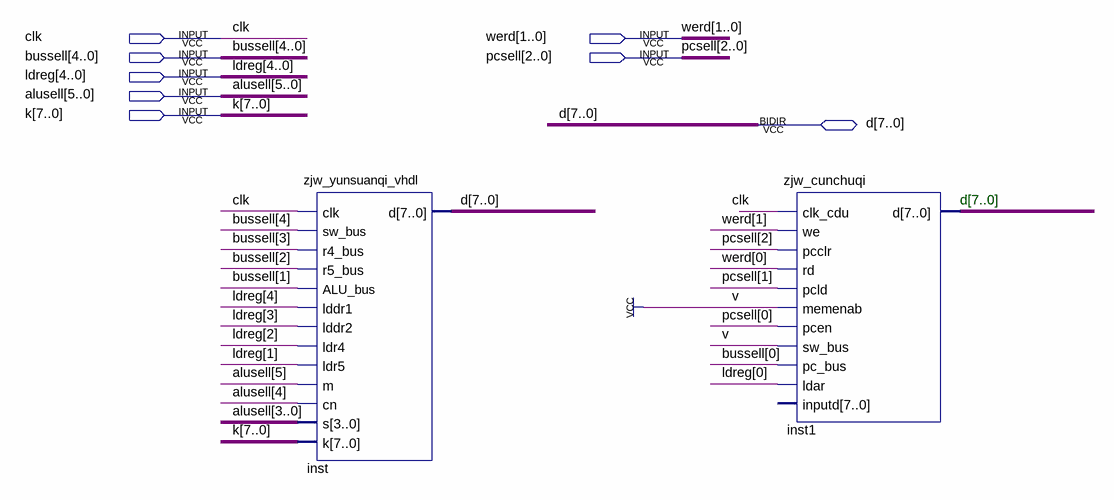
[diagram p0: schematic sheet]
// Quartus schematic zjw_shujutonglu.bdf as structural Verilog: 2 symbols, 8 pins
module zjw_shujutonglu (
  input  clk,
  input  [1:0] werd,
  input  [4:0] bussell,
  input  [2:0] pcsell,
  input  [4:0] ldreg,
  input  [5:0] alusell,
  input  [7:0] k,
  inout  [7:0] d
);

  zjw_yunsuanqi_vhdl inst (
    .clk(clk), .sw_bus(bussell[4]), .r4_bus(bussell[3]), .r5_bus(bussell[2]), .ALU_bus(bussell[1]),
    .lddr1(ldreg[4]), .lddr2(ldreg[3]), .ldr4(ldreg[2]), .ldr5(ldreg[1]), .m(alusell[5]), .cn(alusell[4]),
    .s(alusell[3:0]), .k(k), .d(d));
  zjw_cunchuqi inst1 (
    .clk_cdu(clk), .we(werd[1]), .pcclr(pcsell[2]), .rd(werd[0]), .pcld(pcsell[1]), .memenab(1'b1),
    .pcen(pcsell[0]), .sw_bus(1'b1), .pc_bus(bussell[0]), .ldar(ldreg[0]), .d(d));  // open: inputd

  // Notes on the sheet:
  //   d[7..0]
endmodule
